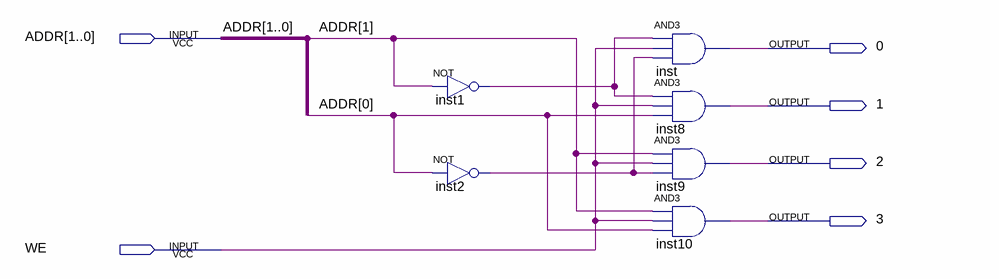
[diagram p0: schematic sheet]
// Quartus schematic De2to4.bdf as structural Verilog: 6 symbols, 6 pins
module De2to4 (
  input  [1:0] ADDR,
  input  WE,
  output \0 ,
  output \1 ,
  output \2 ,
  output \3 
);

  wire inst1_out, inst2_out;

  not inst1 (inst1_out, ADDR[1]);
  not inst2 (inst2_out, ADDR[0]);
  and inst (\0 , inst1_out, WE, inst2_out);
  and inst8 (\1 , inst1_out, WE, ADDR[0]);
  and inst9 (\2 , ADDR[1], WE, inst2_out);
  and inst10 (\3 , ADDR[1], WE, ADDR[0]);
endmodule
